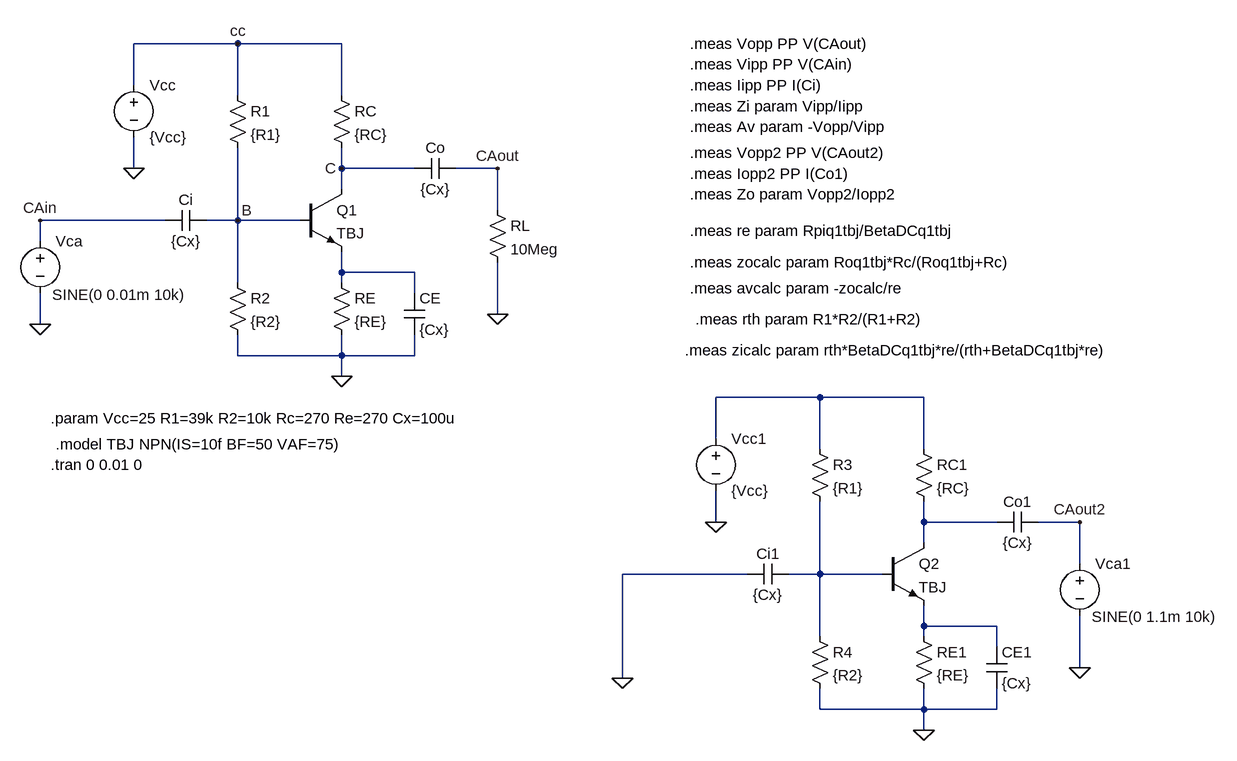
[diagram p0: schematic TBJ02CA.asc]
TBJ02CA.asc, the LTspice schematic file:
Version 4
SHEET 1 1668 1200
WIRE 128 -16 -32 -16
WIRE 288 -16 128 -16
WIRE -32 48 -32 -16
WIRE 128 64 128 -16
WIRE 288 64 288 -16
WIRE -32 176 -32 128
WIRE 288 176 288 144
WIRE 400 176 288 176
WIRE 528 176 464 176
WIRE 288 208 288 176
WIRE 528 240 528 176
WIRE 16 256 -176 256
WIRE 128 256 128 144
WIRE 128 256 80 256
WIRE 224 256 128 256
WIRE -176 288 -176 256
WIRE 288 336 288 304
WIRE 400 336 288 336
WIRE 128 352 128 256
WIRE 288 352 288 336
WIRE 400 368 400 336
WIRE 528 400 528 320
WIRE -176 416 -176 368
WIRE 128 464 128 432
WIRE 288 464 288 432
WIRE 288 464 128 464
WIRE 400 464 400 432
WIRE 400 464 288 464
WIRE 288 496 288 464
WIRE 1024 528 864 528
WIRE 1184 528 1024 528
WIRE 864 592 864 528
WIRE 1024 608 1024 528
WIRE 1184 608 1184 528
WIRE 864 720 864 672
WIRE 1184 720 1184 688
WIRE 1296 720 1184 720
WIRE 1424 720 1360 720
WIRE 1184 752 1184 720
WIRE 1424 784 1424 720
WIRE 912 800 720 800
WIRE 1024 800 1024 688
WIRE 1024 800 976 800
WIRE 1120 800 1024 800
WIRE 1184 880 1184 848
WIRE 1296 880 1184 880
WIRE 1024 896 1024 800
WIRE 1184 896 1184 880
WIRE 1296 912 1296 880
WIRE 1424 944 1424 864
WIRE 720 960 720 800
WIRE 1024 1008 1024 976
WIRE 1184 1008 1184 976
WIRE 1184 1008 1024 1008
WIRE 1296 1008 1296 976
WIRE 1296 1008 1184 1008
WIRE 1184 1040 1184 1008
FLAG -32 176 0
FLAG 288 496 0
FLAG -176 416 0
FLAG 128 -16 cc
FLAG -176 256 CAin
FLAG 528 400 0
FLAG 528 176 CAout
FLAG 128 256 B
FLAG 288 176 C
FLAG 864 720 0
FLAG 1184 1040 0
FLAG 720 960 0
FLAG 1424 944 0
FLAG 1424 720 CAout2
SYMBOL res 112 48 R0
SYMATTR InstName R1
SYMATTR Value {R1}
SYMBOL res 272 48 R0
SYMATTR InstName RC
SYMATTR Value {RC}
SYMBOL voltage -32 32 R0
WINDOW 123 0 0 Left 0
WINDOW 39 0 0 Left 0
SYMATTR InstName Vcc
SYMATTR Value {Vcc}
SYMBOL npn 224 208 R0
SYMATTR InstName Q1
SYMATTR Value TBJ
SYMBOL cap 80 240 R90
WINDOW 0 0 32 VBottom 2
WINDOW 3 32 32 VTop 2
SYMATTR InstName Ci
SYMATTR Value {Cx}
SYMBOL cap 464 160 R90
WINDOW 0 0 32 VBottom 2
WINDOW 3 32 32 VTop 2
SYMATTR InstName Co
SYMATTR Value {Cx}
SYMBOL voltage -176 272 R0
WINDOW 123 0 0 Left 0
WINDOW 39 0 0 Left 0
WINDOW 3 18 98 Left 2
SYMATTR Value SINE(0 0.01m 10k)
SYMATTR InstName Vca
SYMBOL res 512 224 R0
SYMATTR InstName RL
SYMATTR Value 10Meg
SYMBOL res 272 336 R0
SYMATTR InstName RE
SYMATTR Value {RE}
SYMBOL cap 384 368 R0
SYMATTR InstName CE
SYMATTR Value {Cx}
SYMBOL res 112 336 R0
SYMATTR InstName R2
SYMATTR Value {R2}
SYMBOL res 1008 592 R0
SYMATTR InstName R3
SYMATTR Value {R1}
SYMBOL res 1168 592 R0
SYMATTR InstName RC1
SYMATTR Value {RC}
SYMBOL voltage 864 576 R0
WINDOW 123 0 0 Left 0
WINDOW 39 0 0 Left 0
SYMATTR InstName Vcc1
SYMATTR Value {Vcc}
SYMBOL npn 1120 752 R0
SYMATTR InstName Q2
SYMATTR Value TBJ
SYMBOL cap 976 784 R90
WINDOW 0 0 32 VBottom 2
WINDOW 3 32 32 VTop 2
SYMATTR InstName Ci1
SYMATTR Value {Cx}
SYMBOL cap 1360 704 R90
WINDOW 0 0 32 VBottom 2
WINDOW 3 32 32 VTop 2
SYMATTR InstName Co1
SYMATTR Value {Cx}
SYMBOL voltage 1424 768 R0
WINDOW 123 0 0 Left 0
WINDOW 39 0 0 Left 0
WINDOW 3 18 98 Left 2
SYMATTR Value SINE(0 1.1m 10k)
SYMATTR InstName Vca1
SYMBOL res 1168 880 R0
SYMATTR InstName RE1
SYMATTR Value {RE}
SYMBOL cap 1280 912 R0
SYMATTR InstName CE1
SYMATTR Value {Cx}
SYMBOL res 1008 880 R0
SYMATTR InstName R4
SYMATTR Value {R2}
TEXT -160 632 Left 2 !.tran 0 0.01 0
TEXT 824 16 Left 2 !.meas Vipp PP V(CAin)
TEXT 824 48 Left 2 !.meas Iipp PP I(Ci)
TEXT 824 80 Left 2 !.meas Zi param Vipp/Iipp
TEXT 824 -16 Left 2 !.meas Vopp PP V(CAout)
TEXT 824 112 Left 2 !.meas Av param -Vopp/Vipp
TEXT 824 152 Left 2 !.meas Vopp2 PP V(CAout2)
TEXT 824 184 Left 2 !.meas Iopp2 PP I(Co1)
TEXT 824 216 Left 2 !.meas Zo param Vopp2/Iopp2
TEXT -160 560 Left 2 !.param Vcc=25 R1=39k R2=10k Rc=270 Re=270 Cx=100u
TEXT -152 600 Left 2 !.model TBJ NPN(IS=10f BF=50 VAF=75)
TEXT 824 272 Left 2 !.meas re param Rpiq1tbj/BetaDCq1tbj
TEXT 824 320 Left 2 !.meas zocalc param Roq1tbj*Rc/(Roq1tbj+Rc)
TEXT 824 360 Left 2 !.meas avcalc param -zocalc/re
TEXT 832 408 Left 2 !.meas rth param R1*R2/(R1+R2)
TEXT 816 456 Left 2 !.meas zicalc param rth*BetaDCq1tbj*re/(rth+BetaDCq1tbj*re)

The netlist it stands for:
* TBJ02CA.asc
R1 cc B {R1}
RC cc C {RC}
Vcc cc 0 {Vcc}
Q1 C B N001 0 TBJ
Ci B CAin {Cx}
Co CAout C {Cx}
Vca CAin 0 SINE(0 0.01m 10k)
RL CAout 0 10Meg
RE N001 0 {RE}
CE N001 0 {Cx}
R2 B 0 {R2}
R3 N002 N004 {R1}
RC1 N002 N003 {RC}
Vcc1 N002 0 {Vcc}
Q2 N003 N004 N005 0 TBJ
Ci1 N004 0 {Cx}
Co1 CAout2 N003 {Cx}
Vca1 CAout2 0 SINE(0 1.1m 10k)
RE1 N005 0 {RE}
CE1 N005 0 {Cx}
R4 N004 0 {R2}
.model NPN NPN
.model PNP PNP
.lib standard.bjt
.tran 0 0.01 0
.meas Vipp PP V(CAin)
.meas Iipp PP I(Ci)
.meas Zi param Vipp/Iipp
.meas Vopp PP V(CAout)
.meas Av param -Vopp/Vipp
.meas Vopp2 PP V(CAout2)
.meas Iopp2 PP I(Co1)
.meas Zo param Vopp2/Iopp2
.param Vcc=25 R1=39k R2=10k Rc=270 Re=270 Cx=100u
.model TBJ NPN(IS=10f BF=50 VAF=75)
.meas re param Rpiq1tbj/BetaDCq1tbj
.meas zocalc param Roq1tbj*Rc/(Roq1tbj+Rc)
.meas avcalc param -zocalc/re
.meas rth param R1*R2/(R1+R2)
.meas zicalc param rth*BetaDCq1tbj*re/(rth+BetaDCq1tbj*re)
.backanno
.end